# Altium schematic sheet Control.SchDoc: =ProjectName
size A4; CheckedBy: DatNB; Author: Ven; CompanyName: Nacentech; Organization: IMET
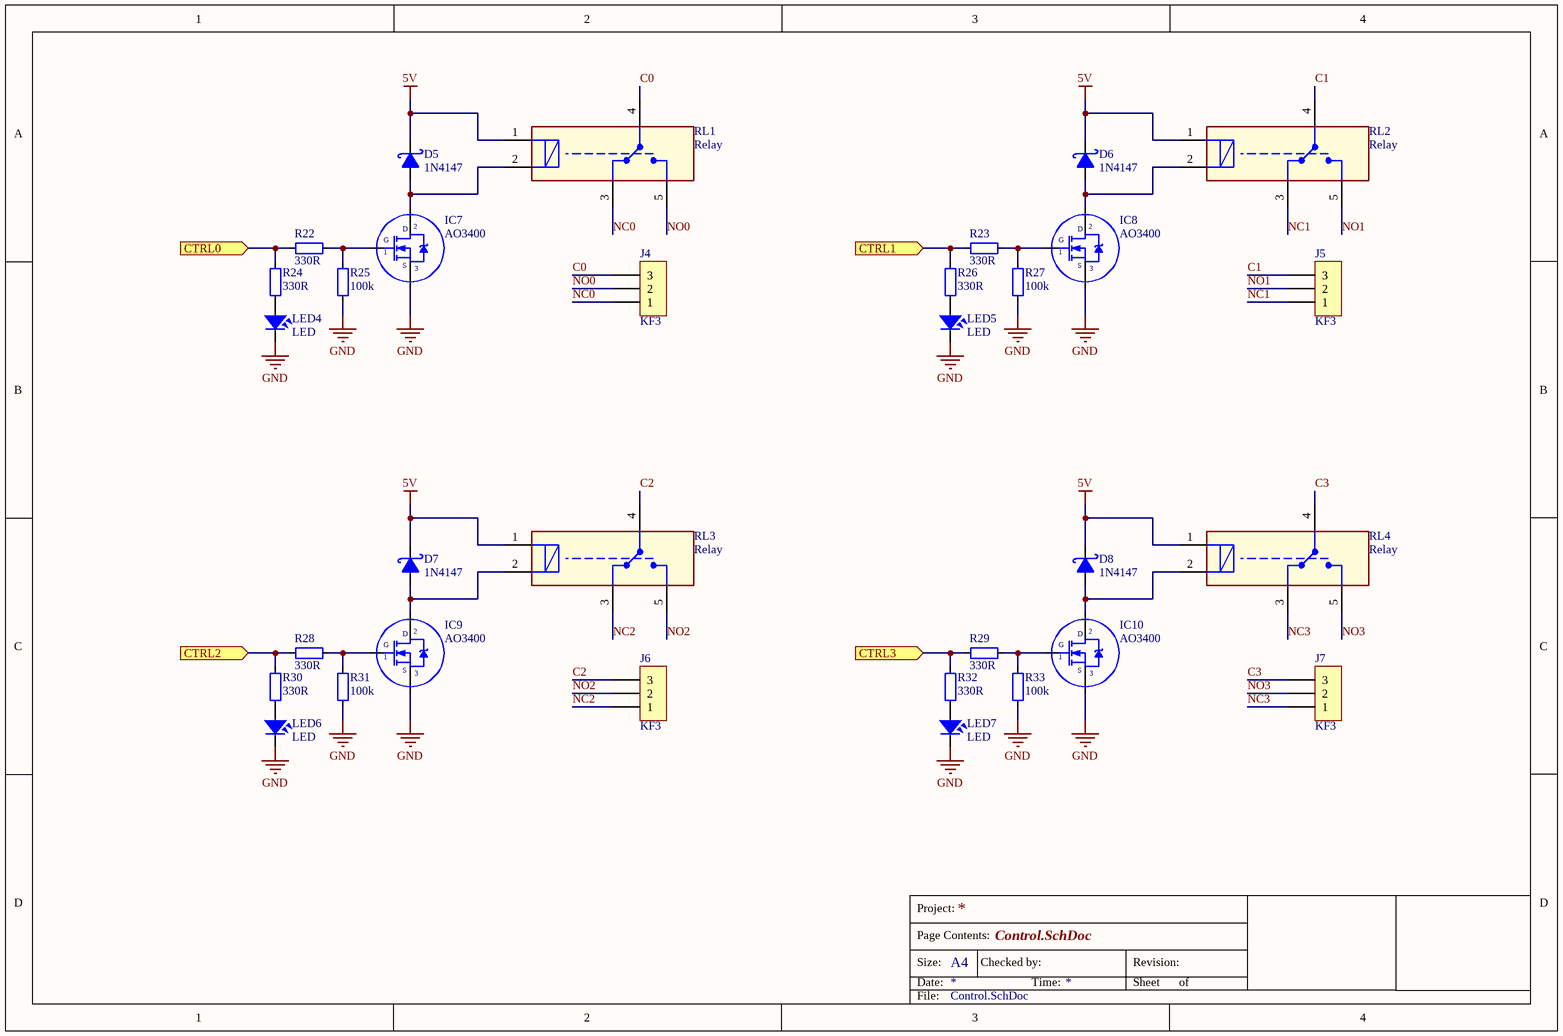
[diagram p0: Control.SchDoc]

## Parts
D5  1N4147  [DIO_R_SMD]
D6  1N4147  [DIO_R_SMD]
D7  1N4147  [DIO_R_SMD]
D8  1N4147  [DIO_R_SMD]
IC7  AO3400  [SOT23A]
IC8  AO3400  [SOT23A]
IC9  AO3400  [SOT23A]
IC10  AO3400  [SOT23A]
J4  KF3  [KF3-3.5-EDG]
J5  KF3  [KF3-3.5-EDG]
J6  KF3  [KF3-3.5-EDG]
J7  KF3  [KF3-3.5-EDG]
LED4  LED  [LED-0805-Red]
LED5  LED  [LED-0805-Red]
LED6  LED  [LED-0805-Red]
LED7  LED  [LED-0805-Red]
R22  330R  [RES-SMD-0805]
R23  330R  [RES-SMD-0805]
R24  330R  [RES-SMD-0805]
R25  100k  [RES-SMD-0805]
R26  330R  [RES-SMD-0805]
R27  100k  [RES-SMD-0805]
R28  330R  [RES-SMD-0805]
R29  330R  [RES-SMD-0805]
R30  330R  [RES-SMD-0805]
R31  100k  [RES-SMD-0805]
R32  330R  [RES-SMD-0805]
R33  100k  [RES-SMD-0805]
RL1  Relay  [HF115F-XXX-1Z]
RL2  Relay  [HF115F-XXX-1Z]
RL3  Relay  [HF115F-XXX-1Z]
RL4  Relay  [HF115F-XXX-1Z]

## Ports
CTRL0 (in), CTRL1 (in), CTRL2 (in), CTRL3 (in)

## Nets
5V: D5.2(K) D6.2(K) D7.2(K) D8.2(K) RL1.1(+) RL2.1(+) RL3.1(+) RL4.1(+)
GND: IC7.3(S) IC8.3(S) IC9.3(S) IC10.3(S) LED4.2 LED5.2 LED6.2 LED7.2 R25.1 R27.1 R31.1 R33.1
C0: J4.3 RL1.4(C)
C1: J5.3 RL2.4(C)
C2: J6.3 RL3.4(C)
C3: J7.3 RL4.4(C)
CTRL0: R22.1 R24.1 ; port CTRL0
CTRL1: R23.1 R26.1 ; port CTRL1
CTRL2: R28.1 R30.1 ; port CTRL2
CTRL3: R29.1 R32.1 ; port CTRL3
NC0: J4.1 RL1.3(NC)
NC1: J5.1 RL2.3(NC)
NC2: J6.1 RL3.3(NC)
NC3: J7.1 RL4.3(NC)
NO0: J4.2 RL1.5(NO)
NO1: J5.2 RL2.5(NO)
NO2: J6.2 RL3.5(NO)
NO3: J7.2 RL4.5(NO)
NetD5_1: D5.1(A) IC7.2(D) RL1.2(-)
NetD6_1: D6.1(A) IC8.2(D) RL2.2(-)
NetD7_1: D7.1(A) IC9.2(D) RL3.2(-)
NetD8_1: D8.1(A) IC10.2(D) RL4.2(-)
NetIC7_1: IC7.1(G) R22.2 R25.2
NetIC8_1: IC8.1(G) R23.2 R27.2
NetIC9_1: IC9.1(G) R28.2 R31.2
NetIC10_1: IC10.1(G) R29.2 R33.2
NetLED4_1: LED4.1 R24.2
NetLED5_1: LED5.1 R26.2
NetLED6_1: LED6.1 R30.2
NetLED7_1: LED7.1 R32.2

## Notes on the sheet
- Project:
- Page Contents:
- Size:
- Date:
- A4
- Checked by:
- Time:
- Revision:
- Sheet
- of
- File:

## Library data of the parts
D5-D8 = Diode Schottky: Generic Diode Schottky
IC7-IC10 = MOSFET_N: Generic N Channel MOSFET
J4-J7 = KF3: Manufacturer: Würth Elektronik eiSos GmbH; partNo: 691103110003; ComponentLink1 Description: Manufacturer; ComponentLink2 Description: Datasheet; NoPins: 3; Created Date: 29 October 2013; ComponentLink1URL: http://www.we-online.com; ComponentLink2URL: http://katalog.we-online.de/em/datasheet/6911031100xx.pdf; Created by: Karrer Zheng
LED4-LED7 = LED: LED Single colour Green and Red; Value: LED 3 ly Single Colour
R22-R33 = Resistor - SMD: Resistor; Manufacturer: Generic Components; Class: Passive; Published: 08/06/2000; Publisher: Altium Hobart Technology Centre
RL1-RL4 = Relay_HF: Relay 12V, 220VAC/5A, 4 pins